# Altium schematic sheet Keys.SchDoc
size A4
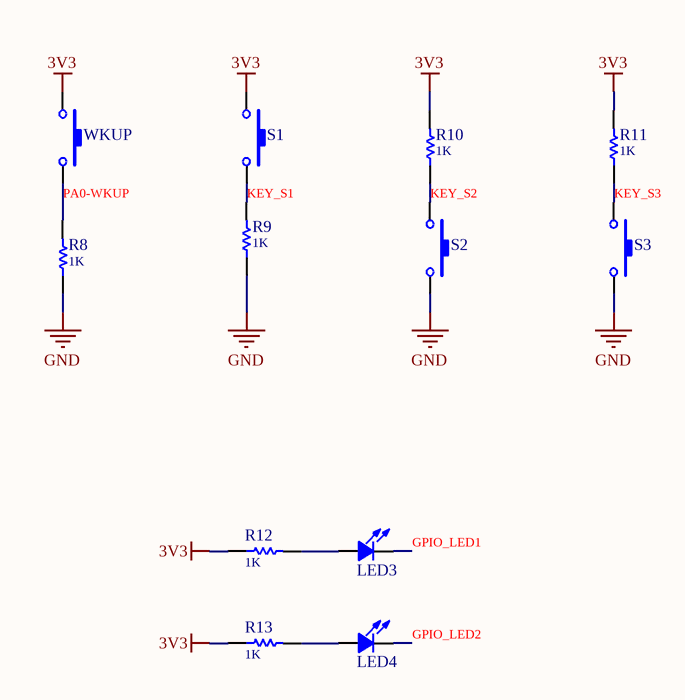
[diagram p0: Keys.SchDoc]

## Parts
LED3  LED  [Led-0805_L]  (value not drawn)
LED4  LED  [Led-0805_L]  (value not drawn)
R8  value 1K  [R0603-L]  (hidden comment: R)
R9  value 1K  [R0603-L]  (hidden comment: R)
R10  value 1K  [R0603-L]  (hidden comment: R)
R11  value 1K  [R0603-L]  (hidden comment: R)
R12  value 1K  [R0603-L]  (hidden comment: R)
R13  value 1K  [R0603-L]  (hidden comment: R)
S1  SW-PB2  [SW-PB2-SMD]  (value not drawn)
S2  SW-PB2  [SW-PB2-SMD]  (value not drawn)
S3  SW-PB2  [SW-PB2-SMD]  (value not drawn)
WKUP  SW-PB2  [SW-PB2-SMD]  (value not drawn)

## Nets
3V3: R10.2 R11.2 R12.1 R13.1 S1.1 WKUP.1
GND: R8.1 R9.1 S2.2 S3.2
GPIO_LED1: LED3.2
GPIO_LED2: LED4.2
KEY_S1: R9.2 S1.2
KEY_S2: R10.1 S2.1
KEY_S3: R11.1 S3.1
PA0-WKUP: R8.2 WKUP.2
NetLED3_1: LED3.1 R12.2
NetLED4_1: LED4.1 R13.2

## Library data of the parts
LED3 LED4 = LED: 发光二极管
R8-R13 = Res: 贴片电阻
S1-S3 WKUP = SW-PB2: 贴片式2脚微动开关